# Altium schematic sheet LM704A0_3V3_PINOUT.SchDoc
size C; SheetNumber: 8; SheetTotal: 19
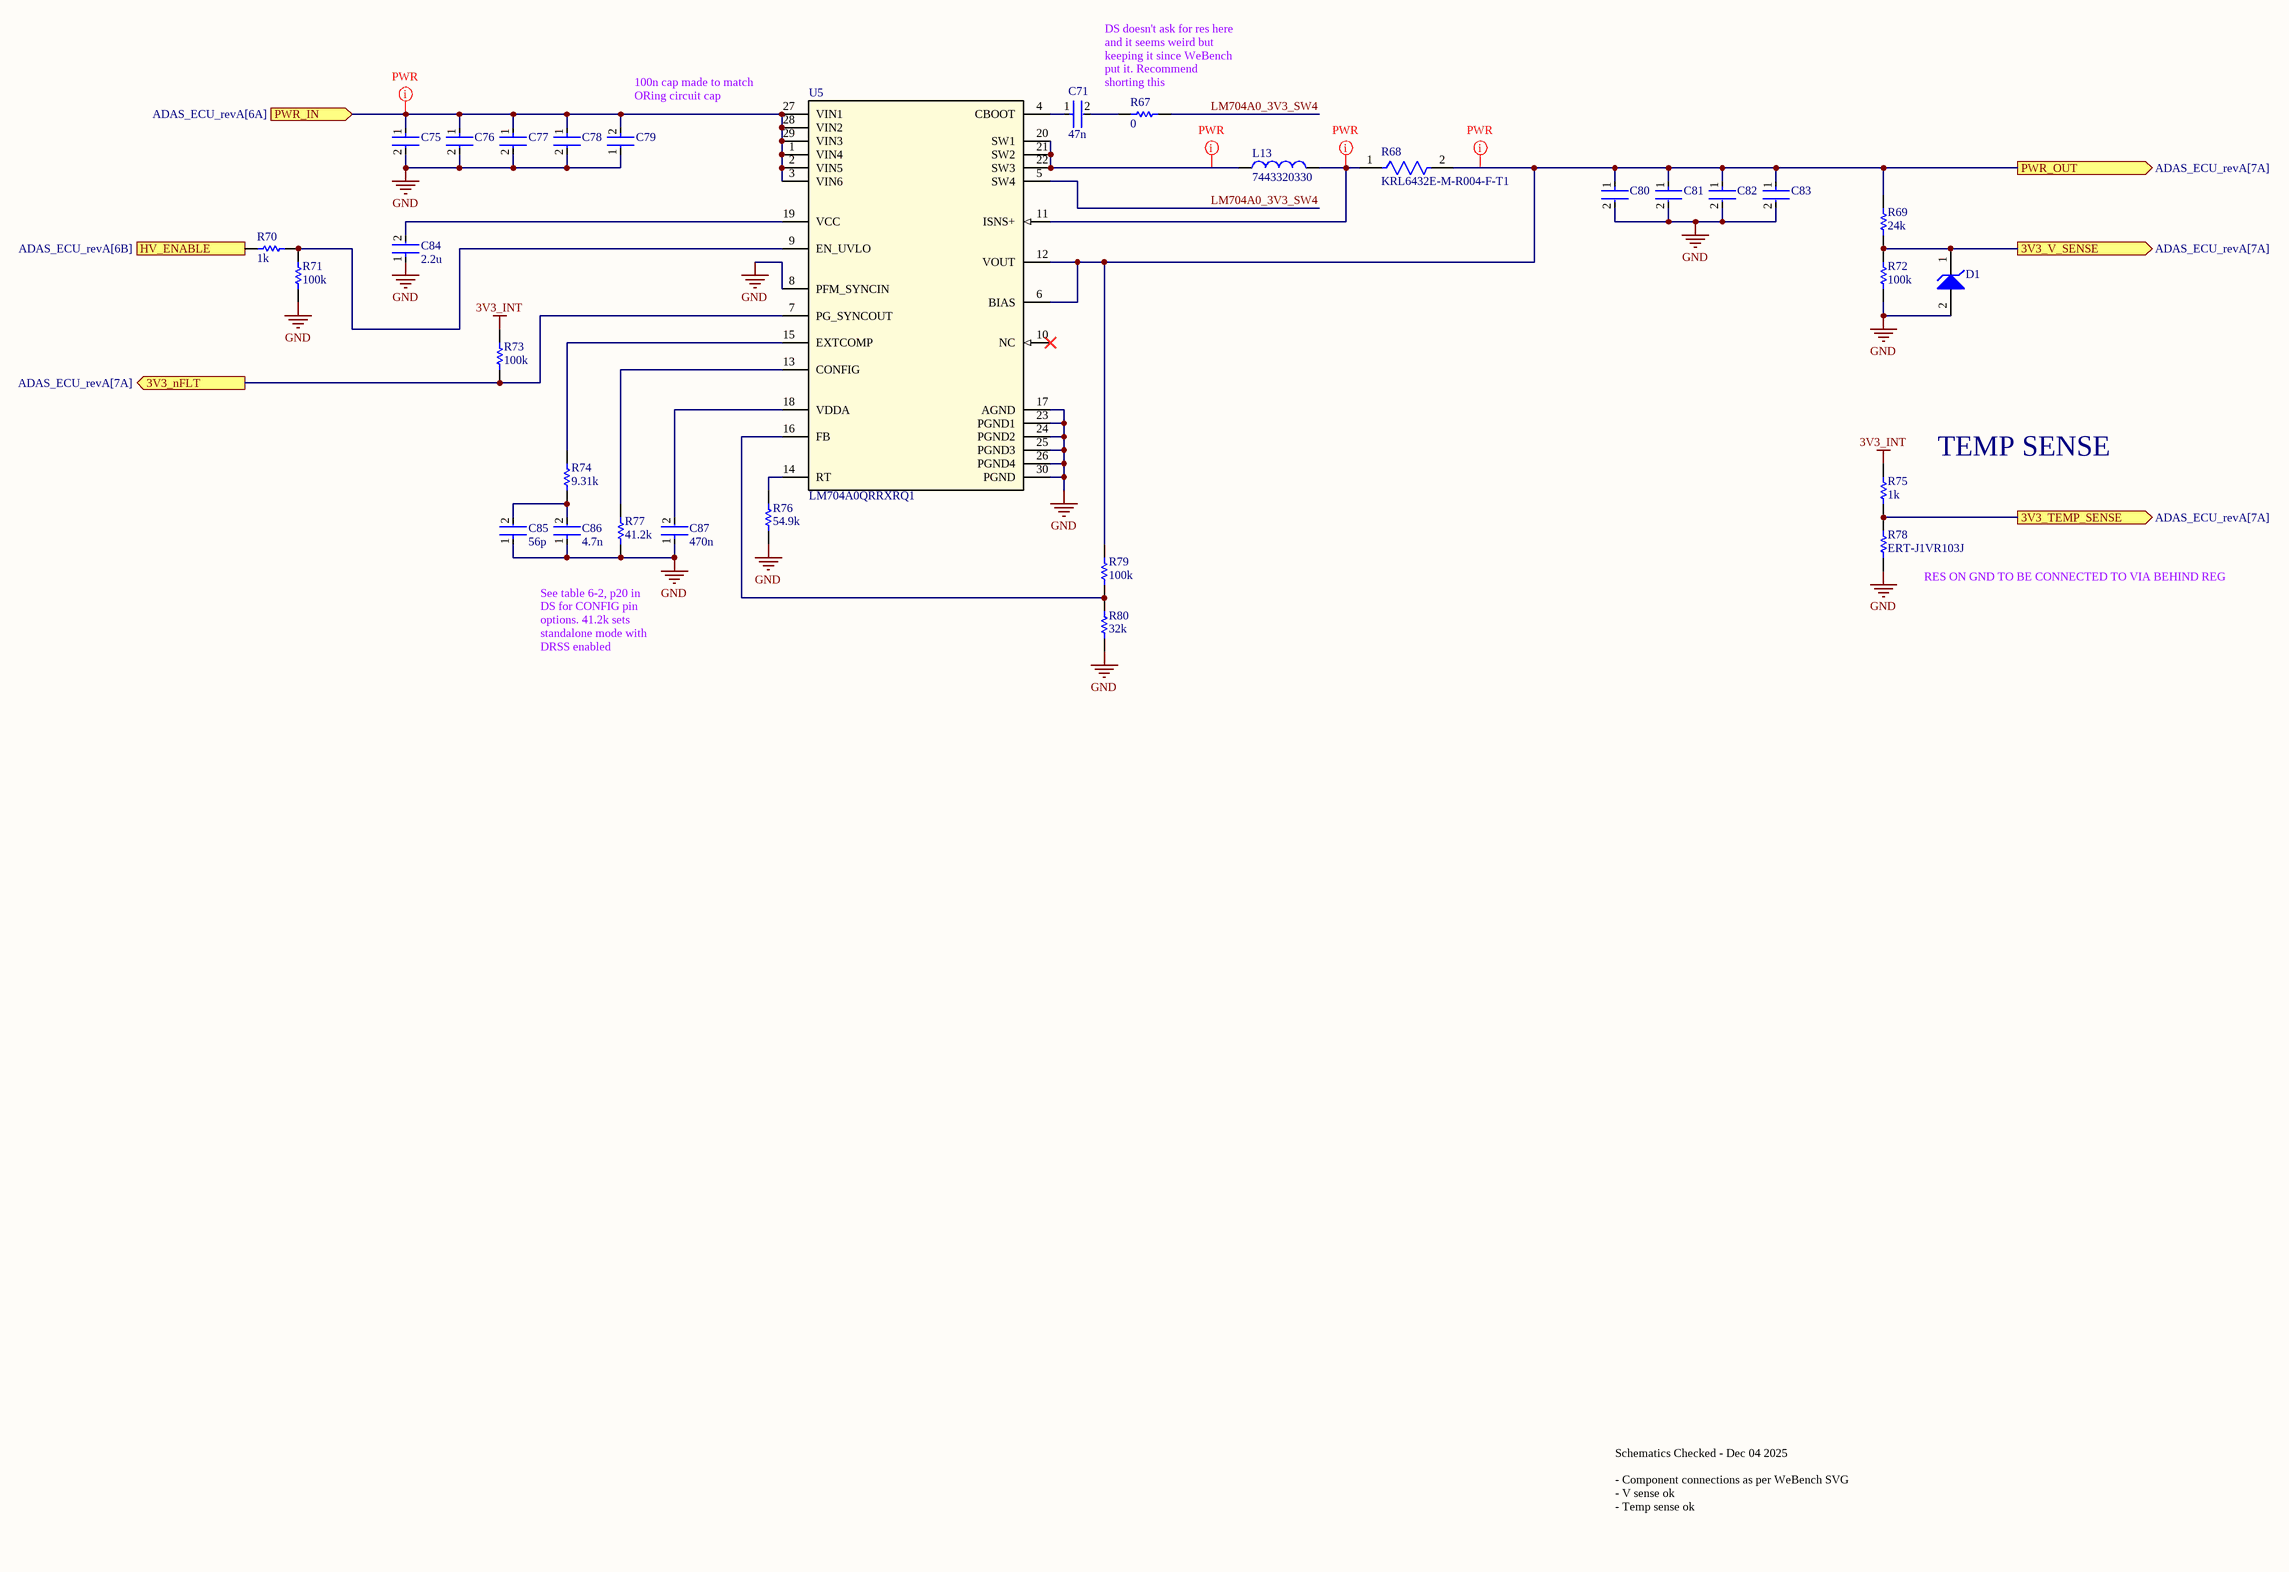
[diagram p0: LM704A0_3V3_PINOUT.SchDoc]

## Parts
C71  47n  [FP-0402-L_1_0_0_05-W_0_5-IPC_A]
C75  C3225X7R1H106M250AC  [FP-C3225-250-0_4-MFG]  (value not drawn)
C76  C3225X7R1H106M250AC  [FP-C3225-250-0_4-MFG]  (value not drawn)
C77  C3225X7R1H106M250AC  [FP-C3225-250-0_4-MFG]  (value not drawn)
C78  C3225X7R1H106M250AC  [FP-C3225-250-0_4-MFG]  (value not drawn)
C79  AC1210KKX7R0BB104  [FP-AC1210-0_85-MFG]  (value not drawn)
C80  GRM32EC80J107ME20L  [FP-GRM32E-0_3-0_2-IPC_C]  (value not drawn)
C81  GRM32EC80J107ME20L  [FP-GRM32E-0_3-0_2-IPC_C]  (value not drawn)
C82  GRM32EC80J107ME20L  [FP-GRM32E-0_3-0_2-IPC_C]  (value not drawn)
C83  GRM32EC80J107ME20L  [FP-GRM32E-0_3-0_2-IPC_C]  (value not drawn)
C84  2.2u  [FP-0402-L_1_0_0_05-W_0_5-IPC_A]
C85  56p  [FP-0402-L_1_0_0_05-W_0_5-IPC_A]
C86  4.7n  [FP-0402-L_1_0_0_05-W_0_5-IPC_A]
C87  470n  [FP-0402-L_1_0_0_05-W_0_5-IPC_A]
D1  DNP/MM5Z3V3T1G  [ONSC-SOD-523-2-502-01_V]  (value not drawn)
L13  7443320330  [WE-HCC_1210]
R67  0  [R0603B]
R68  KRL6432E-M-R004-F-T1  [FP-KRL6432E-MFG]
R69  24k  [R0603B]
R70  1k  [R0603B]
R71  100k  [R0603B]
R72  100k  [R0603B]
R73  100k  [R0603B]
R74  9.31k  [R0603B]
R75  1k  [R0603B]
R76  54.9k  [R0603B]
R77  41.2k  [R0603B]
R78  ERT-J1VR103J  [RESC1608X90X30ML15T20]
R79  100k  [R0603B]
R80  32k  [R0603B]
U5  LM704A0QRRXRQ1  [LM704A0QRRXRQ1-Footprint-1]

## Ports
3V3_nFLT (out, see ADAS_ECU_revA[7A]), 3V3_TEMP_SENSE (out, see ADAS_ECU_revA[7A]), 3V3_V_SENSE (out, see ADAS_ECU_revA[7A]), HV_ENABLE (in, see ADAS_ECU_revA[6B]), PWR_IN (in, see ADAS_ECU_revA[6A]), PWR_OUT (out, see ADAS_ECU_revA[7A])

## Nets
3V3_INT: R73.2 R75.1
GND: C75.2 C76.2 C77.2 C78.2 C79.1 C80.2 C81.2 C82.2 C83.2 C84.1 C85.1 C86.1 C87.1 D1.2(A) R71.1 R72.2 R76.2 R77.2 R78.1 R80.2 U5.8(PFM_SYNCIN) U5.17(AGND) U5.23(PGND1) U5.24(PGND2) U5.25(PGND3) U5.26(PGND4) U5.30(PGND)
3V3_nFLT: R73.1 U5.7(PG_SYNCOUT) ; port 3V3_nFLT
3V3_TEMP_SENSE: R75.2 R78.2 ; port 3V3_TEMP_SENSE
3V3_V_SENSE: D1.1(K) R69.2 R72.1 ; port 3V3_V_SENSE
HV_ENABLE: R70.2 ; port HV_ENABLE
LM704A0_3V3_SW4: R67.2 U5.5(SW4)
PWR_IN: C75.1 C76.1 C77.1 C78.1 C79.2 U5.1(VIN4) U5.2(VIN5) U5.3(VIN6) U5.27(VIN1) U5.28(VIN2) U5.29(VIN3) ; port PWR_IN
PWR_OUT: C80.1 C81.1 C82.1 C83.1 R68.2 R69.1 R79.1 U5.6(BIAS) U5.12(VOUT) ; port PWR_OUT
NetC71_1: C71.1 U5.4(CBOOT)
NetC71_2: C71.2 R67.1
NetC84_2: C84.2 U5.19(VCC)
NetC85_2: C85.2 C86.2 R74.2
NetC87_2: C87.2 U5.18(VDDA)
NetL13_1: L13.1 U5.20(SW1) U5.21(SW2) U5.22(SW3)
NetL13_2: L13.2 R68.1 U5.11(ISNS+)
NetR70_1: R70.1 R71.2 U5.9(EN_UVLO)
NetR74_1: R74.1 U5.15(EXTCOMP)
NetR76_1: R76.1 U5.14(RT)
NetR77_1: R77.1 U5.13(CONFIG)
NetR79_2: R79.2 R80.1 U5.16(FB)

Not connected (* = marked no-connect by the designer): U5 10(NC)*

## Layout directives
net class PWR: NetL13_1, NetL13_2, PWR_IN, PWR_OUT

## Notes on the sheet
- 100n cap made to match ORing circuit cap
- DS doesn't ask for res here and it seems weird but keeping it since WeBench put it. Recommend shorting this
- TEMP SENSE
- (near R78) RES ON GND TO BE CONNECTED TO VIA BEHIND REG
- See table 6-2, p20 in DS for CONFIG pin options. 41.2k sets standalone mode with DRSS enabled
- Schematics Checked - Dec 04 2025
  - Component connections as per WeBench SVG
  - V sense ok
  - Temp sense ok

## Library data of the parts
C71 C84-C87 = CMP-001-00058-1: LARGE PADS, 0402 CAP, CHANGE COMMENT TO MATCH REAL P/N; Capacitor Type: Ceramic; Min Operating Temperature: -55°C; Mounting Technology: Surface Mount; Pins: 2; Case/Package: 0402; RoHS Compliant: Yes; Max Operating Temperature: 85°C
C75-C78 = CMP-08246-002653-1: Multilayer Ceramic Capacitors 10uF ±20% 50V X7R SMD 1210; Width: 0.098inch; Package Quantity: 1000; Height: 2.5mm; Dielectric Material: Ceramic; Voltage Rating: 50V; Series: C; Capacitance: 10uF; Tolerance: 20%; Weight: 0.000564oz; Case/Package: 1210; Case Code (Imperial): 1210; Dielectric: X7R; Case Code (Metric): 3225; REACH SVHC: No SVHC; Packaging: Tape and Reel; Length: 0.126inch; Termination: SMD/SMT; Min Operating Temperature: -55°C; Voltage Rating (DC): 50V; Lead Free: Lead Free; Max Operating Temperature: 125°C; Thickness: 0.11inch; Mount: Surface Mount
C79 = CMP-03422-000642-1: CAP CER 0.1UF 100V X7R 1210; Manufacturer: Yageo; Automotive Grade: Grade 1; Capacitance: 100 nF; Material: Ceramic; Value: 100 nF; Temperature Coefficient: 15%; Tolerance: 0.1; Automotive: Yes; ComponentLink2Description: Datasheet; Device Class L2: Capacitors; Height: 0.95mm; Manufacturer Part Number: AC1210KKX7R0BB104; Temperature: -55°C to +125°C; Voltage Rating: 100 V; Device Class L1: Passive Components; ComponentLink2URL: http://www.yageo.com/documents/recent/UPY-AC_NP0X7R_16V-to-630V_12.pdf; Lead Free: Yes; Category: Cap; Temperature Range High: +125°C; RoHS: TRUE; Digikey Description: CAP CER 0.1UF 100V X7R 1210; Temperature Range Low: -55°C; Octopart: https://octopart.com/ac1210kkx7r0bb104-yageo-78873719; Device Class L3: Ceramic Capacitors; Ipc Land Pattern Name: CAPC320250X85; Package: AC1210-0.85; Footprint Url: http://www.yageo.com/exep/pages/download/literatures/UPY-C_GEN_24.pdf; Temperature Characteristic: X7R
C80-C83 = CMP-2000-06362-2: DIFF P/N 100UF 6.3V GRM32EC80J107ME20L; Voltage: 16V; Tolerance: 10%; Capacitance: 47uF; Dielectric: X5R; Material: Ceramic; Case Code (Metric): 3225; RoHS Compliant: Yes; Min Operating Temperature: -55°C; Radiation Hardening: No; Package Quantity: 1; Case Code (Imperial): 1210; REACH SVHC: No SVHC; Voltage Rating (DC): 16V; Case/Package: 1210; Length: 3.2mm; Voltage Rating: 16V; Packaging: Cut Tape; Width: 0.098inch; Number of Pins: 2; Lead Free: Lead Free; Height: 2.5mm; Mount: Surface Mount; Termination: SMD/SMT; Max Operating Temperature: 85°C; Thickness: 0.106inch; Depth: 2.5mm
D1 = CMP-1060-00750-1: Zener Voltage Regulator, 500 mW, 2-Pin SOD-523, Pb-Free, Tape and Reel; Manufacturer: On Semiconductor; P Max (W): 0.5; VZ Typ (V): 3.3; RoHS: Pb-Free; ComponentLink2Description: Datasheet; PackageReference: SOD-523-2-502-01; DatasheetVersion: Rev. 10; ComponentLink1Description: Manufacturer URL; PackageVersion: Rev. E, 09/2010; ComponentLink3URL: http://www.onsemi.com/pub_link/Collateral/502-01.PDF; ComponentLink2URL: http://www.onsemi.cn/pub_link/Collateral/MM5Z2V4T1-D.PDF; Mounting Technology: Surface Mount; PartNumber: MM5Z3V3T1G; Packing: Tape and Reel; PackageDescription: 2-Pin SOD, Body 1.2 x 0.8 mm; ComponentLink1URL: http://www.onsemi.com/; ComponentLink3Description: Package Specification
L13 = CMP-0226-00120-2: NexarPartId: 22803324; Self Resonant Frequency: 44MHz; DC Resistance (DCR): 5.2mΩ; Saturation Current: 22.4A; Inductance Tolerance: 20%; Material: Ferrite; Inductance: 3.3µH; Current Rating: 17A; Height: 9.5mm; Number of Pins: 2; Length: 12.1mm; Width: 11.4mm; Packaging: Tape & Reel (TR); Ambient Temperature Range High: 75°C; RoHS: Compliant; Max Operating Temperature: 125°C; Min Operating Temperature: -40°C; Ambient Temperature Range Low: -40°C; Core Material: Ferrite
R67 R70-R77 R79 R80 = CMP-009-00002-14: Resistor
  R72: Value: 100k
  R75: Value: 1k
R68 = CMP-00597-24927457-1: KRL6432E-M-R004-F-T1 Metal Foil Low Resistance Chip Resistor (long-side terminal), 2512, RoHS; Power Rating: 3W; Temperature Coefficient: 50ppm/°C; Tolerance: 1%; Resistance: 4mΩ; Length: 3.1mm; Composition: Metal Foil; Termination: SMD/SMT; Max Operating Temperature: 155°C; Case Code (Imperial): 2512; NexarPartId: 24927457; Width: 6.3mm; Max Power Dissipation: 3W; Case Code (Metric): 6432; Min Operating Temperature: -55°C; Packaging: Digi-Reel®; Max Thickness: 700µm; Lifecycle Status: Production; Height: 700µm; Weight: 40.511469mg; Case/Package: 2512; RoHS: Compliant; Number of Terminations: 2
R69 = CMP-009-00002-14: Resistor; Value: 100k
R78 = CMP-2000-00869-1: Manufacturer: Panasonic; Part Number: ERT-J1VR103J
U5 = CMP-019-00058-1: Automotive, High-density, 4.5V to 45V input, 10A low-EMI synchronous DC/DC step-down converter 29-VQFN -40 to 150; Case/Package: VQFN; Pins: 29